# Altium schematic sheet Block_Diagram.SchDoc
size A4; Organization: Altium Limited; Address1: L3, 12a Rodborough Rd; Address2: Frenchs Forest; Address3: NSW; Address4: Australia 2086
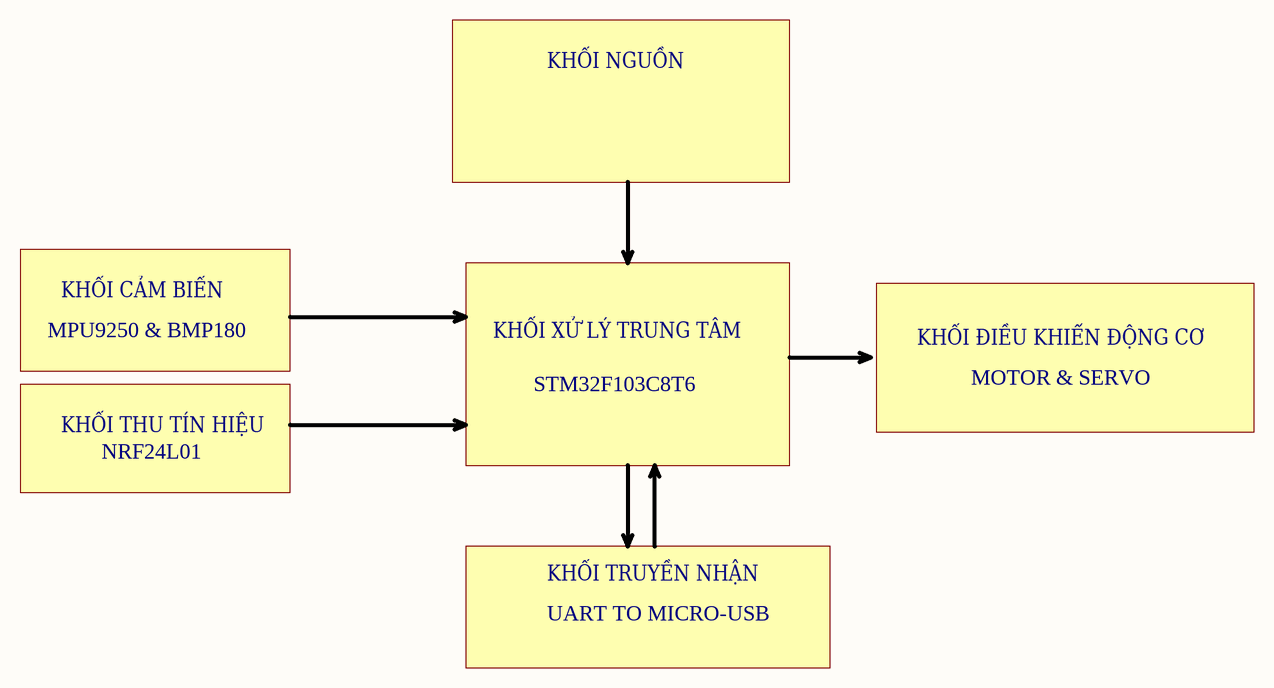
[diagram p0: Block_Diagram.SchDoc]

## Notes on the sheet
- KHỐI NGUỒN
- KHỐI CẢM BIẾN
- MPU9250 & BMP180
- KHỐI XỬ LÝ TRUNG TÂM
- KHỐI ĐIỀU KHIỂN ĐỘNG CƠ
- MOTOR & SERVO
- KHỐI THU TÍN HIỆU
- STM32F103C8T6
- NRF24L01
- KHỐI TRUYỀN NHẬN
- UART TO MICRO-USB
- Title
- Size:
- Date:
- A4
- Number:
- Time:
- Revision:
- Sheet
- of
- File: